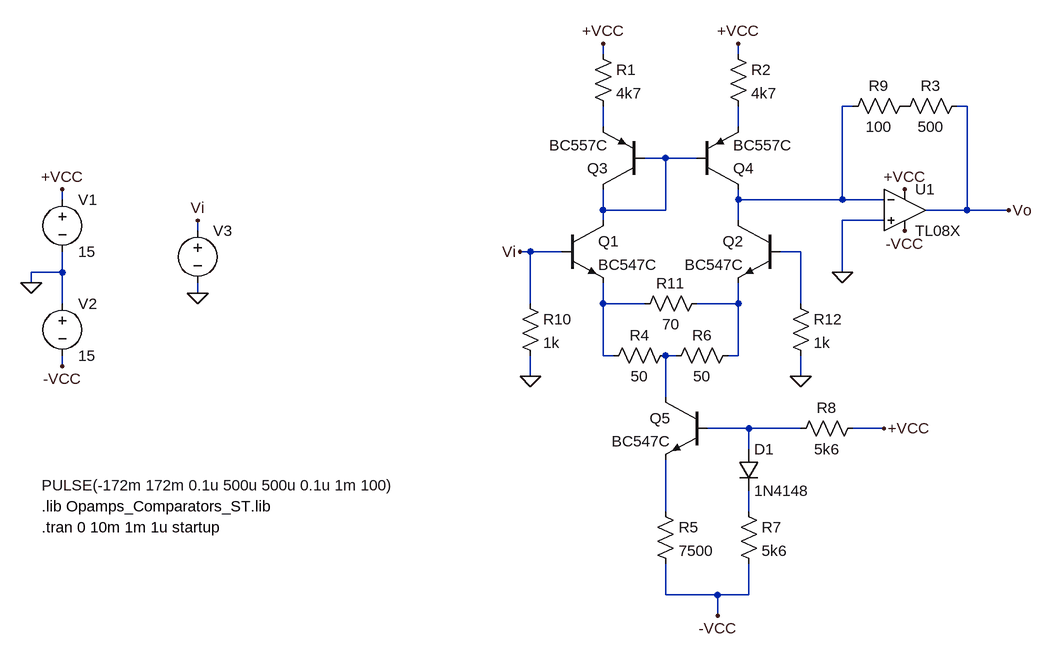
[diagram p0: schematic TriangleToSinConverter.asc]
TriangleToSinConverter.asc, the LTspice schematic file:
Version 4
SHEET 1 880 680
WIRE -224 -352 -224 -368
WIRE -16 -352 -16 -368
WIRE 160 -272 144 -272
WIRE 336 -272 320 -272
WIRE -224 -240 -224 -272
WIRE -16 -240 -16 -272
WIRE -128 -192 -160 -192
WIRE -80 -192 -128 -192
WIRE -1056 -128 -1056 -144
WIRE -16 -128 -16 -144
WIRE 144 -128 144 -272
WIRE 144 -128 -16 -128
WIRE 208 -128 144 -128
WIRE -224 -112 -224 -144
WIRE -128 -112 -128 -192
WIRE -128 -112 -224 -112
WIRE 336 -112 336 -272
WIRE 336 -112 272 -112
WIRE 400 -112 336 -112
WIRE -224 -96 -224 -112
WIRE -16 -96 -16 -128
WIRE 208 -96 144 -96
WIRE -848 -80 -848 -96
WIRE -336 -48 -352 -48
WIRE -288 -48 -336 -48
WIRE 80 -48 48 -48
WIRE -1056 -16 -1056 -48
WIRE -1056 -16 -1104 -16
WIRE 144 -16 144 -96
WIRE -1104 0 -1104 -16
WIRE -848 16 -848 0
WIRE -1056 32 -1056 -16
WIRE -336 32 -336 -48
WIRE -224 32 -224 0
WIRE -160 32 -224 32
WIRE -16 32 -16 0
WIRE -16 32 -80 32
WIRE 80 32 80 -48
WIRE -224 112 -224 32
WIRE -208 112 -224 112
WIRE -112 112 -128 112
WIRE -16 112 -16 32
WIRE -16 112 -32 112
WIRE -1056 128 -1056 112
WIRE -336 144 -336 112
WIRE 80 144 80 112
WIRE -128 176 -128 112
WIRE 0 224 -64 224
WIRE 80 224 0 224
WIRE 208 224 160 224
WIRE 0 256 0 224
WIRE -128 352 -128 272
WIRE 0 352 0 320
WIRE -128 480 -128 432
WIRE -48 480 -128 480
WIRE 0 480 0 432
WIRE 0 480 -48 480
WIRE -48 512 -48 480
FLAG -1104 0 0
FLAG -1056 -144 +VCC
FLAG -1056 128 -VCC
FLAG -848 16 0
FLAG -848 -96 Vi
FLAG -16 -368 +VCC
FLAG -224 -368 +VCC
FLAG 240 -144 +VCC
FLAG 240 -80 -VCC
FLAG 144 -16 0
FLAG 400 -112 Vo
FLAG -48 512 -VCC
FLAG 208 224 +VCC
FLAG -336 144 0
FLAG -352 -48 Vi
FLAG 80 144 0
SYMBOL voltage -1056 -144 R0
WINDOW 123 0 0 Left 0
WINDOW 39 0 0 Left 0
SYMATTR InstName V1
SYMATTR Value 15
SYMBOL voltage -1056 16 R0
WINDOW 123 0 0 Left 0
WINDOW 39 0 0 Left 0
SYMATTR InstName V2
SYMATTR Value 15
SYMBOL voltage -848 -96 R0
WINDOW 3 -240 407 Left 2
WINDOW 123 0 0 Left 0
WINDOW 39 0 0 Left 0
SYMATTR Value PULSE(-172m 172m 0.1u 500u 500u 0.1u 1m 100)
SYMATTR InstName V3
SYMBOL npn -288 -96 R0
SYMATTR InstName Q1
SYMATTR Value BC547C
SYMBOL npn 48 -96 M0
SYMATTR InstName Q2
SYMATTR Value BC547C
SYMBOL res -240 -368 R0
SYMATTR InstName R1
SYMATTR Value 4k7
SYMBOL res -32 -368 R0
SYMATTR InstName R2
SYMATTR Value 4k7
SYMBOL pnp -160 -144 R180
SYMATTR InstName Q3
SYMATTR Value BC557C
SYMBOL pnp -80 -144 M180
SYMATTR InstName Q4
SYMATTR Value BC557C
SYMBOL Opamps\\opamp2 240 -176 R0
SYMATTR InstName U1
SYMATTR Value TL08X
SYMBOL res 336 -288 R90
WINDOW 0 0 56 VBottom 2
WINDOW 3 32 56 VTop 2
SYMATTR InstName R3
SYMATTR Value 500
SYMBOL npn -64 176 M0
SYMATTR InstName Q5
SYMATTR Value BC547C
SYMBOL res -144 336 R0
SYMATTR InstName R5
SYMATTR Value 7500
SYMBOL res -16 336 R0
SYMATTR InstName R7
SYMATTR Value 5k6
SYMBOL res 176 208 R90
WINDOW 0 0 56 VBottom 2
WINDOW 3 32 56 VTop 2
SYMATTR InstName R8
SYMATTR Value 5k6
SYMBOL diode -16 256 R0
SYMATTR InstName D1
SYMATTR Value 1N4148
SYMBOL res -112 96 R90
WINDOW 0 0 56 VBottom 2
WINDOW 3 32 56 VTop 2
SYMATTR InstName R4
SYMATTR Value 50
SYMBOL res -16 96 R90
WINDOW 0 0 56 VBottom 2
WINDOW 3 32 56 VTop 2
SYMATTR InstName R6
SYMATTR Value 50
SYMBOL res 256 -288 R90
WINDOW 0 0 56 VBottom 2
WINDOW 3 32 56 VTop 2
SYMATTR InstName R9
SYMATTR Value 100
SYMBOL res -352 16 R0
SYMATTR InstName R10
SYMATTR Value 1k
SYMBOL res -64 16 R90
WINDOW 0 0 56 VBottom 2
WINDOW 3 32 56 VTop 2
SYMATTR InstName R11
SYMATTR Value 70
SYMBOL res 64 16 R0
SYMATTR InstName R12
SYMATTR Value 1k
TEXT -1088 376 Left 2 !.tran 0 10m 1m 1u startup
TEXT -1088 344 Left 2 !.lib Opamps_Comparators_ST.lib

The netlist it stands for:
* TriangleToSinConverter.asc
V1 +VCC 0 15
V2 0 -VCC 15
V3 Vi 0 PULSE(-172m 172m 0.1u 500u 500u 0.1u 1m 100)
Q1 N004 Vi N006 0 BC547C
Q2 N001 N005 N007 0 BC547C
R1 +VCC N002 4k7
R2 +VCC N003 4k7
Q3 N004 N004 N002 0 BC557C
Q4 N001 N004 N003 0 BC557C
XU1 0 N001 +VCC -VCC Vo TL08X  ; pins In+ In- V+ V- OUT
R3 Vo P001 500
Q5 N008 N009 N010 0 BC547C
R5 N010 -VCC 7500
R7 N011 -VCC 5k6
R8 +VCC N009 5k6
D1 N009 N011 1N4148
R4 N008 N006 50
R6 N007 N008 50
R9 P001 N001 100
R10 Vi 0 1k
R11 N007 N006 70
R12 N005 0 1k
.model D D
.lib standard.dio
.model NPN NPN
.model PNP PNP
.lib standard.bjt
.tran 0 10m 1m 1u startup
.lib Opamps_Comparators_ST.lib
.backanno
.end